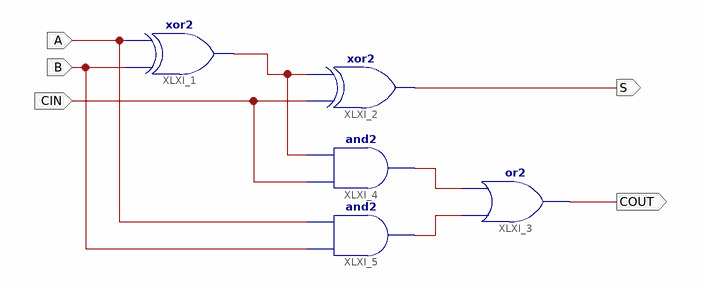
[diagram p0: schematic sheet 1]
// Xilinx ISE schematic full_adder.sch (spartan6) as structural Verilog: 5 symbols, 5 ports
module full_adder (
  input  CIN,
  input  B,
  input  A,
  output S,
  output COUT
);

  wire XLXN_4, XLXN_5, XLXN_6;

  xor XLXI_1 (XLXN_6, B, A);
  xor XLXI_2 (S, CIN, XLXN_6);
  or XLXI_3 (COUT, XLXN_5, XLXN_4);
  and XLXI_4 (XLXN_4, CIN, XLXN_6);
  and XLXI_5 (XLXN_5, B, A);
endmodule
